# Altium schematic sheet eth_lan8742a_phy.SchDoc
size A
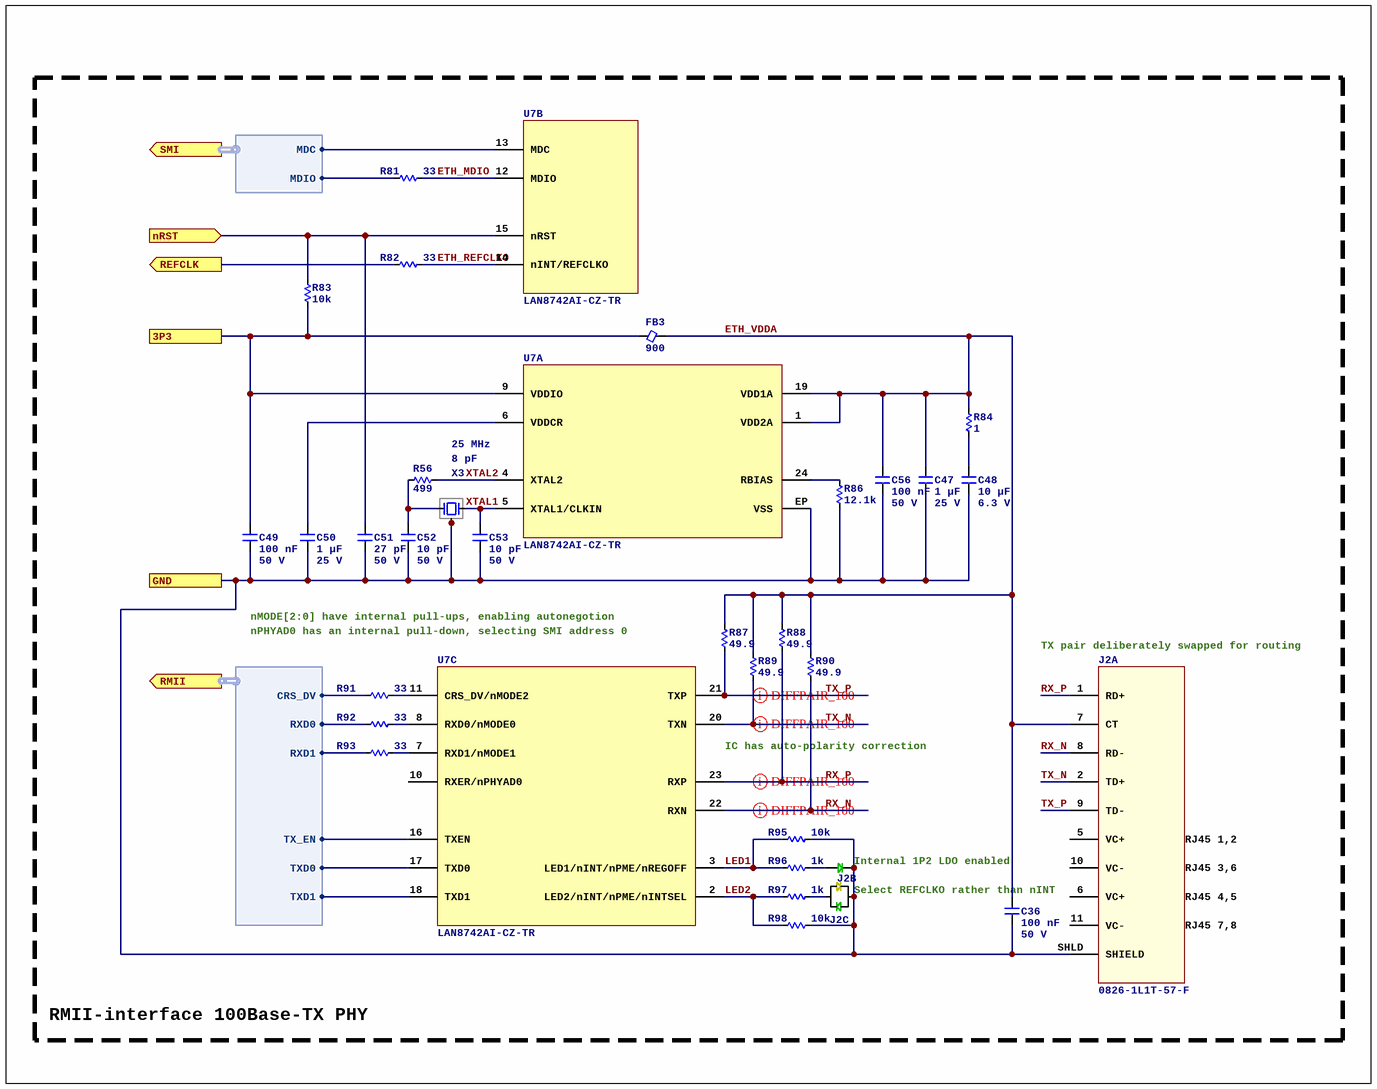
[diagram p0: eth_lan8742a_phy.SchDoc]

## Parts
C36  Capacitance: 100 nF  Voltage Rating: 50 V  [C0402]  (hidden comment: CL05B104KB54PNC)
C47  Capacitance: 1 µF  Voltage Rating: 25 V  [C0603]  (hidden comment: CL10B105KA8NNNC)
C48  Capacitance: 10 µF  Voltage Rating: 6.3 V  [C0805]  (hidden comment: CC0805KKX7R5BB106)
C49  Capacitance: 100 nF  Voltage Rating: 50 V  [C0402]  (hidden comment: CL05B104KB54PNC)
C50  Capacitance: 1 µF  Voltage Rating: 25 V  [C0603]  (hidden comment: CL10B105KA8NNNC)
C51  Capacitance: 27 pF  Voltage Rating: 50 V  [C0402]  (hidden comment: CC0402JRNPO9BN270)
C52  Capacitance: 10 pF  Voltage Rating: 50 V  [C0402]  (hidden comment: CL05C100JB5NNNC)
C53  Capacitance: 10 pF  Voltage Rating: 50 V  [C0402]  (hidden comment: CL05C100JB5NNNC)
C56  Capacitance: 100 nF  Voltage Rating: 50 V  [C0402]  (hidden comment: CL05B104KB54PNC)
FB3  Current Rating (mA): 900  [FB0402]  (hidden comment: BLM15PX601SN1D)
J2  0826-1L1T-57-F  [BELFUSE_0826-1L1T-57-F]  (parts A,B,C of 3)
R56  value 499  [R0402]  (hidden comment: 0402WGF4990TCE)
R81  value 33  [R0402]  (hidden comment: CRCW040233R0FKED)
R82  value 33  [R0402]  (hidden comment: CRCW040233R0FKED)
R83  value 10k  [R0402]  (hidden comment: 0402WGF1002TCE)
R84  value 1  [R0402]  (hidden comment: CRCW04021R00FKEDC)
R86  value 12.1k  [R0402]  (hidden comment: RC0402FR-0712K1L)
R87  value 49.9  [R0402]  (hidden comment: 0402WGF499JTCE)
R88  value 49.9  [R0402]  (hidden comment: 0402WGF499JTCE)
R89  value 49.9  [R0402]  (hidden comment: 0402WGF499JTCE)
R90  value 49.9  [R0402]  (hidden comment: 0402WGF499JTCE)
R91  value 33  [R0402]  (hidden comment: CRCW040233R0FKED)
R92  value 33  [R0402]  (hidden comment: CRCW040233R0FKED)
R93  value 33  [R0402]  (hidden comment: CRCW040233R0FKED)
R95  value 10k  [R0402]  (hidden comment: 0402WGF1002TCE)
R96  value 1k  [R0402]  (hidden comment: 0402WGF1001TCE)
R97  value 1k  [R0402]  (hidden comment: 0402WGF1001TCE)
R98  value 10k  [R0402]  (hidden comment: 0402WGF1002TCE)
U7  LAN8742AI-CZ-TR  [24QFN4E]  (parts A,B,C of 3)
X3  Frequency: 25 MHz  Capacitance: 8 pF  [4_SMD_2.0X1.6MM]  (hidden comment: ABM11W-25.0000MHZ-8-D1X-T3)

## Ports
3P3, GND, nRST (in), REFCLK (out), RMII (out, harness RMII), SMI (out, harness SMI)

## Harnesses
SMI: MDC, MDIO
RMII: CRS_DV, RXD0, RXD1, TX_EN, TXD0, TXD1

## Nets
3P3: C49.1 FB3.1 R83.1 U7.9(VDDIO) ; port 3P3
ETH_MDIO: R81.1 U7.12(MDIO)
ETH_REFCLKO: R82.1 U7.14(nINT/REFCLKO)
ETH_VDDA: C36.1 C47.1 C56.1 FB3.2 J2.7(CT) R84.2 R87.1 R88.1 R89.1 R90.1 U7.1(VDD2A) U7.19(VDD1A)
GND: C36.2 C47.2 C48.2 C49.2 C50.2 C51.2 C52.2 C53.2 C56.2 J2.13 J2.14 J2.SHLD(SHIELD) R86.2 R95.2 R98.2 U7.EP(VSS) X3.2 X3.4 ; port GND
LED1: R95.1 R96.2 U7.3(LED1/nINT/nPME/nREGOFF)
LED2: R97.2 R98.1 U7.2(LED2/nINT/nPME/nINTSEL)
nRST: C51.1 R83.2 U7.15(nRST) ; port nRST
REFCLK: R82.2 ; port REFCLK
RX_N: J2.8(RD-) R90.2 U7.22(RXN)
RX_P: J2.1(RD+) R88.2 U7.23(RXP)
TX_N: J2.2(TD+) R89.2 U7.20(TXN)
TX_P: J2.9(TD-) R87.2 U7.21(TXP)
XTAL1: C53.1 U7.5(XTAL1/CLKIN) X3.3
XTAL2: R56.1 U7.4(XTAL2)
NetC48_1: C48.1 R84.1
NetC50_1: C50.1 U7.6(VDDCR)
NetC52_1: C52.1 R56.2 X3.1
NetJ2_12: J2.12 R97.1
NetJ2_15: J2.15 R96.1
NetR81_2: R81.2 ; port SMI.MDIO
NetR86_1: R86.1 U7.24(RBIAS)
NetR91_1: R91.1 U7.11(CRS_DV/nMODE2)
NetR91_2: R91.2 ; port RMII.CRS_DV
NetR92_1: R92.1 U7.8(RXD0/nMODE0)
NetR92_2: R92.2 ; port RMII.RXD0
NetR93_1: R93.1 U7.7(RXD1/nMODE1)
NetR93_2: R93.2 ; port RMII.RXD1
NetU7_13: U7.13(MDC) ; port SMI.MDC
NetU7_16: U7.16(TXEN) ; port RMII.TX_EN
NetU7_17: U7.17(TXD0) ; port RMII.TXD0
NetU7_18: U7.18(TXD1) ; port RMII.TXD1

Not connected (* = marked no-connect by the designer): J2 5(VC+) 6(VC+) 10(VC-) 11(VC-); U7 10(RXER/nPHYAD0)

## Layout directives
differential pair; differential pair class DE_100: RX_N, RX_P, TX_N, TX_P

## Notes on the sheet
- nMODE[2:0] have internal pull-ups, enabling autonegotion
- nPHYAD0 has an internal pull-down, selecting SMI address 0
- (near J2) TX pair deliberately swapped for routing
- (near U7) IC has auto-polarity correction
- (near J2) Internal 1P2 LDO enabled
- Select REFCLKO rather than nINT
- RMII-interface 100Base-TX PHY
- (in symbol 0826-1L1T-57-F, part A) RJ45 1,2; RJ45 3,6; RJ45 4,5; RJ45 7,8

## Library data of the parts
C36 C49 C56 = CL05B104KB54PNC: Manufacturer: Samsung Electro-Mechanics; Dielectric: X7R; ComponentLink1URL: https://wmsc.lcsc.com/wmsc/upload/file/pdf/v2/lcsc/2304140030_Samsung-Electro-Mechanics-CL05B104KB54PNC_C307331.pdf; ComponentLink1Description: Datasheet; Manufacturer Part Number: CL05B104KB54PNC; Package: 0402; Supplier 2: LCSC; Supplier Part Number 2: C307331
C47 C50 = CL10B105KA8NNNC: Manufacturer: Samsung Electro-Mechanics; Dielectric: X7R; ComponentLink1URL: https://wmsc.lcsc.com/wmsc/upload/file/pdf/v2/lcsc/2304140030_Samsung-Electro-Mechanics-CL10B105KA8NNNC_C29936.pdf; ComponentLink1Description: Datasheet; Manufacturer Part Number: CL10B105KA8NNNC; Package: 0603; Supplier 2: LCSC; Supplier Part Number 2: C29936
C48 = CC0805KKX7R5BB106: Manufacturer: YAGEO; Dielectric: X7R; ComponentLink1URL: https://wmsc.lcsc.com/wmsc/upload/file/pdf/v2/lcsc/2409272300_YAGEO-CC0805KKX7R5BB106_C527225.pdf; ComponentLink1Description: Datasheet; Manufacturer Part Number: CC0805KKX7R5BB106; Package: 0805; Supplier 2: LCSC; Supplier Part Number 2: C527225
C51 = CC0402JRNPO9BN270: Manufacturer: YAGEO; Dielectric: NP0; ComponentLink1URL: https://wmsc.lcsc.com/wmsc/upload/file/pdf/v2/lcsc/2304140030_YAGEO-CC0402JRNPO9BN270_C107002.pdf; ComponentLink1Description: Datasheet; Manufacturer Part Number: CC0402JRNPO9BN270; Package: 0402; Supplier 2: LCSC; Supplier Part Number 2: C107002
C52 C53 = CL05C100JB5NNNC: Manufacturer: Samsung Electro-Mechanics; Dielectric: C0G; ComponentLink1URL: https://wmsc.lcsc.com/wmsc/upload/file/pdf/v2/lcsc/2304140030_Samsung-Electro-Mechanics-CL05C100JB5NNNC_C32949.pdf; ComponentLink1Description: Datasheet; Manufacturer Part Number: CL05C100JB5NNNC; Package: 0402; Supplier 2: LCSC; Supplier Part Number 2: C32949
FB3 = BLM15PX601SN1D: Manufacturer: Murata Electronics; Z @ 100 MHz: 600; DCR (mOhms): 230; ComponentLink1URL: https://wmsc.lcsc.com/wmsc/upload/file/pdf/v2/lcsc/2304140030_Murata-Electronics-BLM15PX601SN1D_C160977.pdf; ComponentLink1Description: Datasheet; Manufacturer Part Number: BLM15PX601SN1D; Supplier 2: LCSC; Supplier Part Number 2: C160977; Package: 0402
J2 = 0826-1L1T-57-F: CONN MAGJACK 1PORT 100 BASE-T; Manufacturer: Bel Fuse Inc; Supplier 1: DigiKey; Supplier Part Number 1: 507-1431-ND; ComponentLink1URL: https://www.belfuse.com/resources/drawings/magneticsolutions/dr-mag-0826-1l1t-57-f.pdf; ComponentLink1Description: Datasheet; Manufacturer Part Number: 0826-1L1T-57-F; Supplier 2: LCSC; Supplier Part Number 2: C3179913; Supplier 3: Mouser; Supplier Part Number 3: 530-0826-1L1T-57-F
R56 = 0402WGF4990TCE: Manufacturer: UNI-ROYAL(Uniroyal Elec); Tolerance: 1%; Temperature Coefficient: ±100ppm/?; Power Rating (mW): 62.5; ComponentLink1Description: Datasheet; ComponentLink1URL: https://wmsc.lcsc.com/wmsc/upload/file/pdf/v2/lcsc/2206010230_UNI-ROYAL-Uniroyal-Elec-0402WGF4990TCE_C4125.pdf; Manufacturer Part Number: 0402WGF4990TCE; Package: 0402; Supplier 2: LCSC; Supplier Part Number 2: C4125
R81 R82 R91-R93 = CRCW040233R0FKED: Manufacturer: Vishay Intertech; Tolerance: 1%; Temperature Coefficient: ±100ppm/?; Power Rating (mW): 63; ComponentLink1Description: Datasheet; ComponentLink1URL: https://wmsc.lcsc.com/wmsc/upload/file/pdf/v2/lcsc/2304140030_Vishay-Intertech-CRCW040233R0FKED_C242490.pdf; Manufacturer Part Number: CRCW040233R0FKED; Package: 0402; Supplier 2: LCSC; Supplier Part Number 2: C242490
R83 R95 R98 = 0402WGF1002TCE: Manufacturer: UNI-ROYAL(Uniroyal Elec); Tolerance: 1%; Temperature Coefficient: ±100ppm/?; Power Rating (mW): 62.5; ComponentLink1Description: Datasheet; ComponentLink1URL: https://wmsc.lcsc.com/wmsc/upload/file/pdf/v2/lcsc/2206010100_UNI-ROYAL-Uniroyal-Elec-0402WGF1002TCE_C25744.pdf; Manufacturer Part Number: 0402WGF1002TCE; Package: 0402; Supplier 2: LCSC; Supplier Part Number 2: C25744
R84 = CRCW04021R00FKEDC: Manufacturer: Vishay Intertech; Tolerance: 1%; Temperature Coefficient: ±100ppm/?; Power Rating (mW): 62.5; ComponentLink1Description: Datasheet; ComponentLink1URL: https://datasheet.lcsc.com/lcsc/2304140030_Vishay-Intertech-CRCW04021R00FKEDC_C2077765.pdf; Manufacturer Part Number: CRCW04021R00FKEDC; Package: 0402; Supplier 2: LCSC; Supplier Part Number 2: C2077765
R86 = RC0402FR-0712K1L: Manufacturer: YAGEO; Tolerance: 1%; Temperature Coefficient: ±100ppm/?; Power Rating (mW): 62.5; ComponentLink1Description: Datasheet; ComponentLink1URL: https://wmsc.lcsc.com/wmsc/upload/file/pdf/v2/lcsc/2304140030_YAGEO-RC0402FR-0712K1L_C132157.pdf; Manufacturer Part Number: RC0402FR-0712K1L; Package: 0402; Supplier 2: LCSC; Supplier Part Number 2: C132157
R87-R90 = 0402WGF499JTCE: Manufacturer: UNI-ROYAL(Uniroyal Elec); Tolerance: 1%; Temperature Coefficient: ±100ppm/?; Power Rating (mW): 62.5; ComponentLink1Description: Datasheet; ComponentLink1URL: https://wmsc.lcsc.com/wmsc/upload/file/pdf/v2/lcsc/2205311900_UNI-ROYAL-Uniroyal-Elec-0402WGF499JTCE_C25120.pdf; Manufacturer Part Number: 0402WGF499JTCE; Package: 0402; Supplier 2: LCSC; Supplier Part Number 2: C25120
R96 R97 = 0402WGF1001TCE: Manufacturer: UNI-ROYAL(Uniroyal Elec); Tolerance: 1%; Temperature Coefficient: ±100ppm/?; Power Rating (mW): 62.5; ComponentLink1Description: Datasheet; ComponentLink1URL: https://wmsc.lcsc.com/wmsc/upload/file/pdf/v2/lcsc/2206010216_UNI-ROYAL-Uniroyal-Elec-0402WGF1001TCE_C11702.pdf; Manufacturer Part Number: 0402WGF1001TCE; Package: 0402; Supplier 2: LCSC; Supplier Part Number 2: C11702
U7 = LAN8742AI-CZ-TR: Ethernet Transceiver, PQCC24; Manufacturer: Microchip; Supplier 1: DigiKey; Supplier Part Number 1: LAN8742AI-CZ-CT-ND; Manufacturer Part Number: LAN8742AI-CZ-TR; ComponentLink1URL: https://ww1.microchip.com/downloads/aemDocuments/documents/OTH/ProductDocuments/DataSheets/DS_LAN8742_00001989A.pdf; ComponentLink1Description: Datasheet; Supplier 2: LCSC; Supplier Part Number 2: C153279; Supplier 3: Mouser; Supplier Part Number 3: 579-LAN8742AI-CZ-TR
X3 = ABM11W-25.0000MHZ-8-D1X-T3: 25 MHz ±10ppm Crystal 8pF 50 Ohms 4-SMD, No Lead; Manufacturer: Abracon LLC; Supplier 1: DigiKey; Supplier Part Number 1: 535-13853-1-ND; Manufacturer Part Number: ABM11W-25.0000MHZ-8-D1X-T3; ComponentLink1Description: Datasheet; ComponentLink1URL: https://abracon.com/Resonators/ABM11W.pdf; Supplier 2: LCSC; Supplier Part Number 2: C1985767; Supplier 3: Mouser; Supplier Part Number 3: 815-11W25-8D1XT